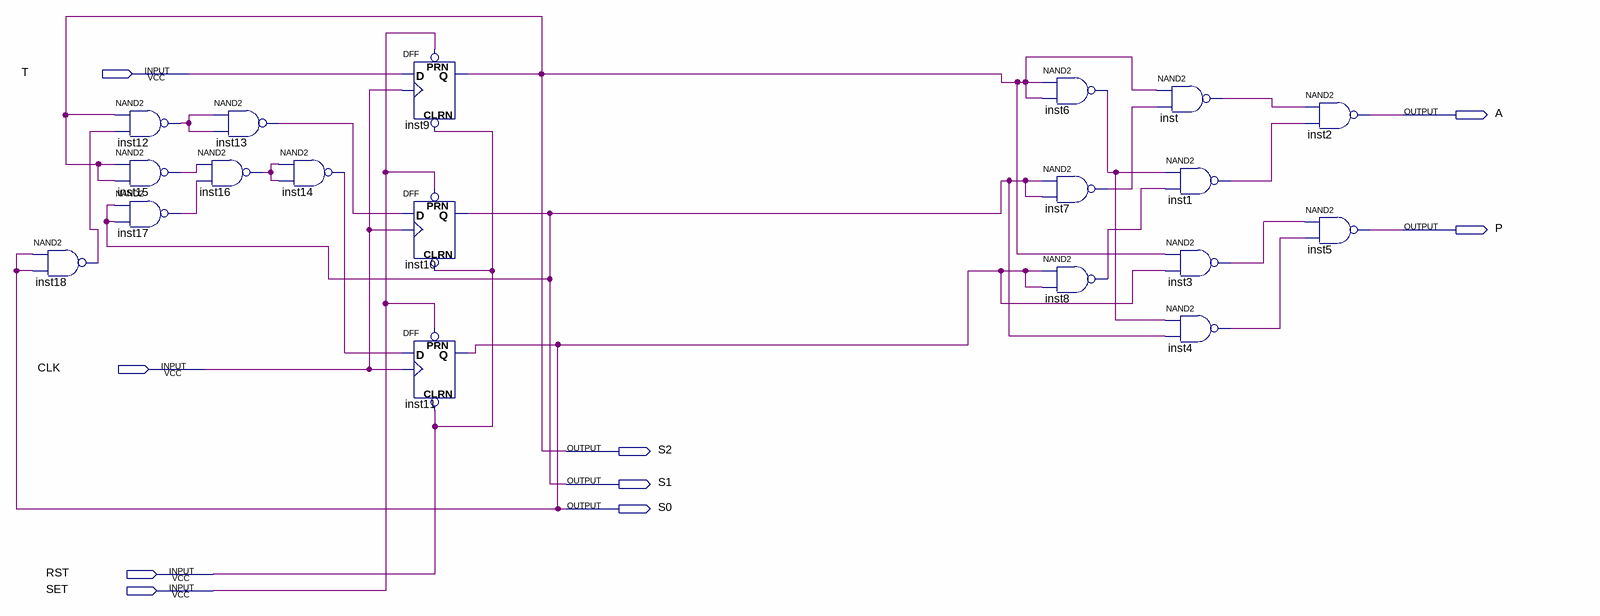
[diagram p0: schematic sheet]
// Quartus schematic lab5NAND_NAND.bdf as structural Verilog: 19 symbols, 9 pins
module lab5NAND_NAND (
  input  T,
  input  CLK,
  input  RST,
  input  SET,
  output A,
  output P,
  output S2,
  output S1,
  output S0
);

  wire inst1_out, inst3_out, inst4_out, inst6_out, inst7_out, inst8_out, inst12_out, inst13_out, inst14_out,
       inst15_out, inst16_out, inst17_out, inst18_out, inst_out;

  nand inst18 (inst18_out, S0, S0);
  nand inst12 (inst12_out, S2, inst18_out);
  nand inst15 (inst15_out, S2, S2);
  nand inst17 (inst17_out, S1, S1);
  nand inst13 (inst13_out, inst12_out, inst12_out);
  nand inst16 (inst16_out, inst15_out, inst17_out);
  nand inst14 (inst14_out, inst16_out, inst16_out);
  DFF inst9 (.CLRN(RST), .CLK(CLK), .D(T), .PRN(SET), .Q(S2));
  DFF inst10 (.CLRN(RST), .CLK(CLK), .D(inst13_out), .PRN(SET), .Q(S1));
  DFF inst11 (.CLRN(RST), .CLK(CLK), .D(inst14_out), .PRN(SET), .Q(S0));
  nand inst6 (inst6_out, S2, S2);
  nand inst7 (inst7_out, S1, S1);
  nand inst8 (inst8_out, S0, S0);
  nand inst (inst_out, S2, inst7_out);
  nand inst1 (inst1_out, inst6_out, inst8_out);
  nand inst3 (inst3_out, S2, S0);
  nand inst4 (inst4_out, inst6_out, S1);
  nand inst2 (A, inst_out, inst1_out);
  nand inst5 (P, inst3_out, inst4_out);
endmodule
